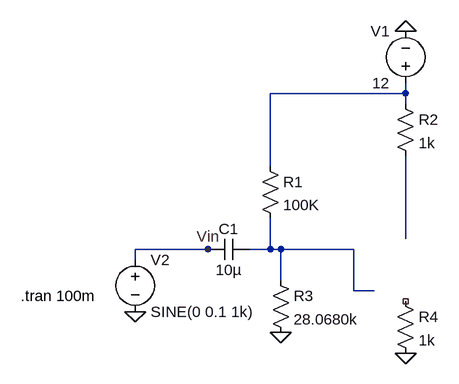
[diagram p0: schematic Lab_5_PartA_1.asc]
Lab_5_PartA_1.asc, the LTspice schematic file:
Version 4
SHEET 1 880 680
WIRE 384 -16 384 -32
WIRE 384 -16 176 -16
WIRE 384 0 384 -16
WIRE 176 96 176 -16
WIRE 384 208 384 80
WIRE 80 224 -32 224
WIRE 96 224 80 224
WIRE 176 224 176 176
WIRE 176 224 144 224
WIRE 192 224 176 224
WIRE 304 224 192 224
WIRE -32 240 -32 224
WIRE 192 272 192 224
WIRE 304 288 304 224
WIRE 336 288 304 288
FLAG 192 352 0
FLAG 80 224 Vin
FLAG -32 320 0
FLAG 384 -112 0
FLAG 384 384 0
SYMBOL res 160 80 R0
SYMATTR InstName R1
SYMATTR Value 100K
SYMBOL res 176 256 R0
SYMATTR InstName R3
SYMATTR Value 28.0680k
SYMBOL cap 144 208 R90
WINDOW 0 0 32 VBottom 2
WINDOW 3 32 32 VTop 2
SYMATTR InstName C1
SYMATTR Value 10µ
SYMBOL voltage -32 224 R0
WINDOW 123 0 0 Left 0
WINDOW 39 0 0 Left 0
SYMATTR InstName V2
SYMATTR Value SINE(0 0.1 1k)
SYMBOL voltage 384 -16 R180
WINDOW 0 24 96 Left 2
WINDOW 3 24 16 Left 2
WINDOW 123 0 0 Left 0
WINDOW 39 0 0 Left 0
SYMATTR InstName V1
SYMATTR Value 12
SYMBOL res 368 -16 R0
SYMATTR InstName R2
SYMATTR Value 1k
SYMBOL res 368 288 R0
SYMATTR InstName R4
SYMATTR Value 1k
TEXT -208 296 Left 2 !.tran 100m

The netlist it stands for:
* Lab_5_PartA_1.asc
R1 N001 N003 100K
R3 N003 0 28.0680k
C1 N003 Vin 10µ
V2 Vin 0 SINE(0 0.1 1k)
V1 N001 0 12
R2 N001 N002 1k
R4 NC_01 0 1k
.tran 100m
.backanno
.end